# Altium schematic sheet regulators.SchDoc
size B
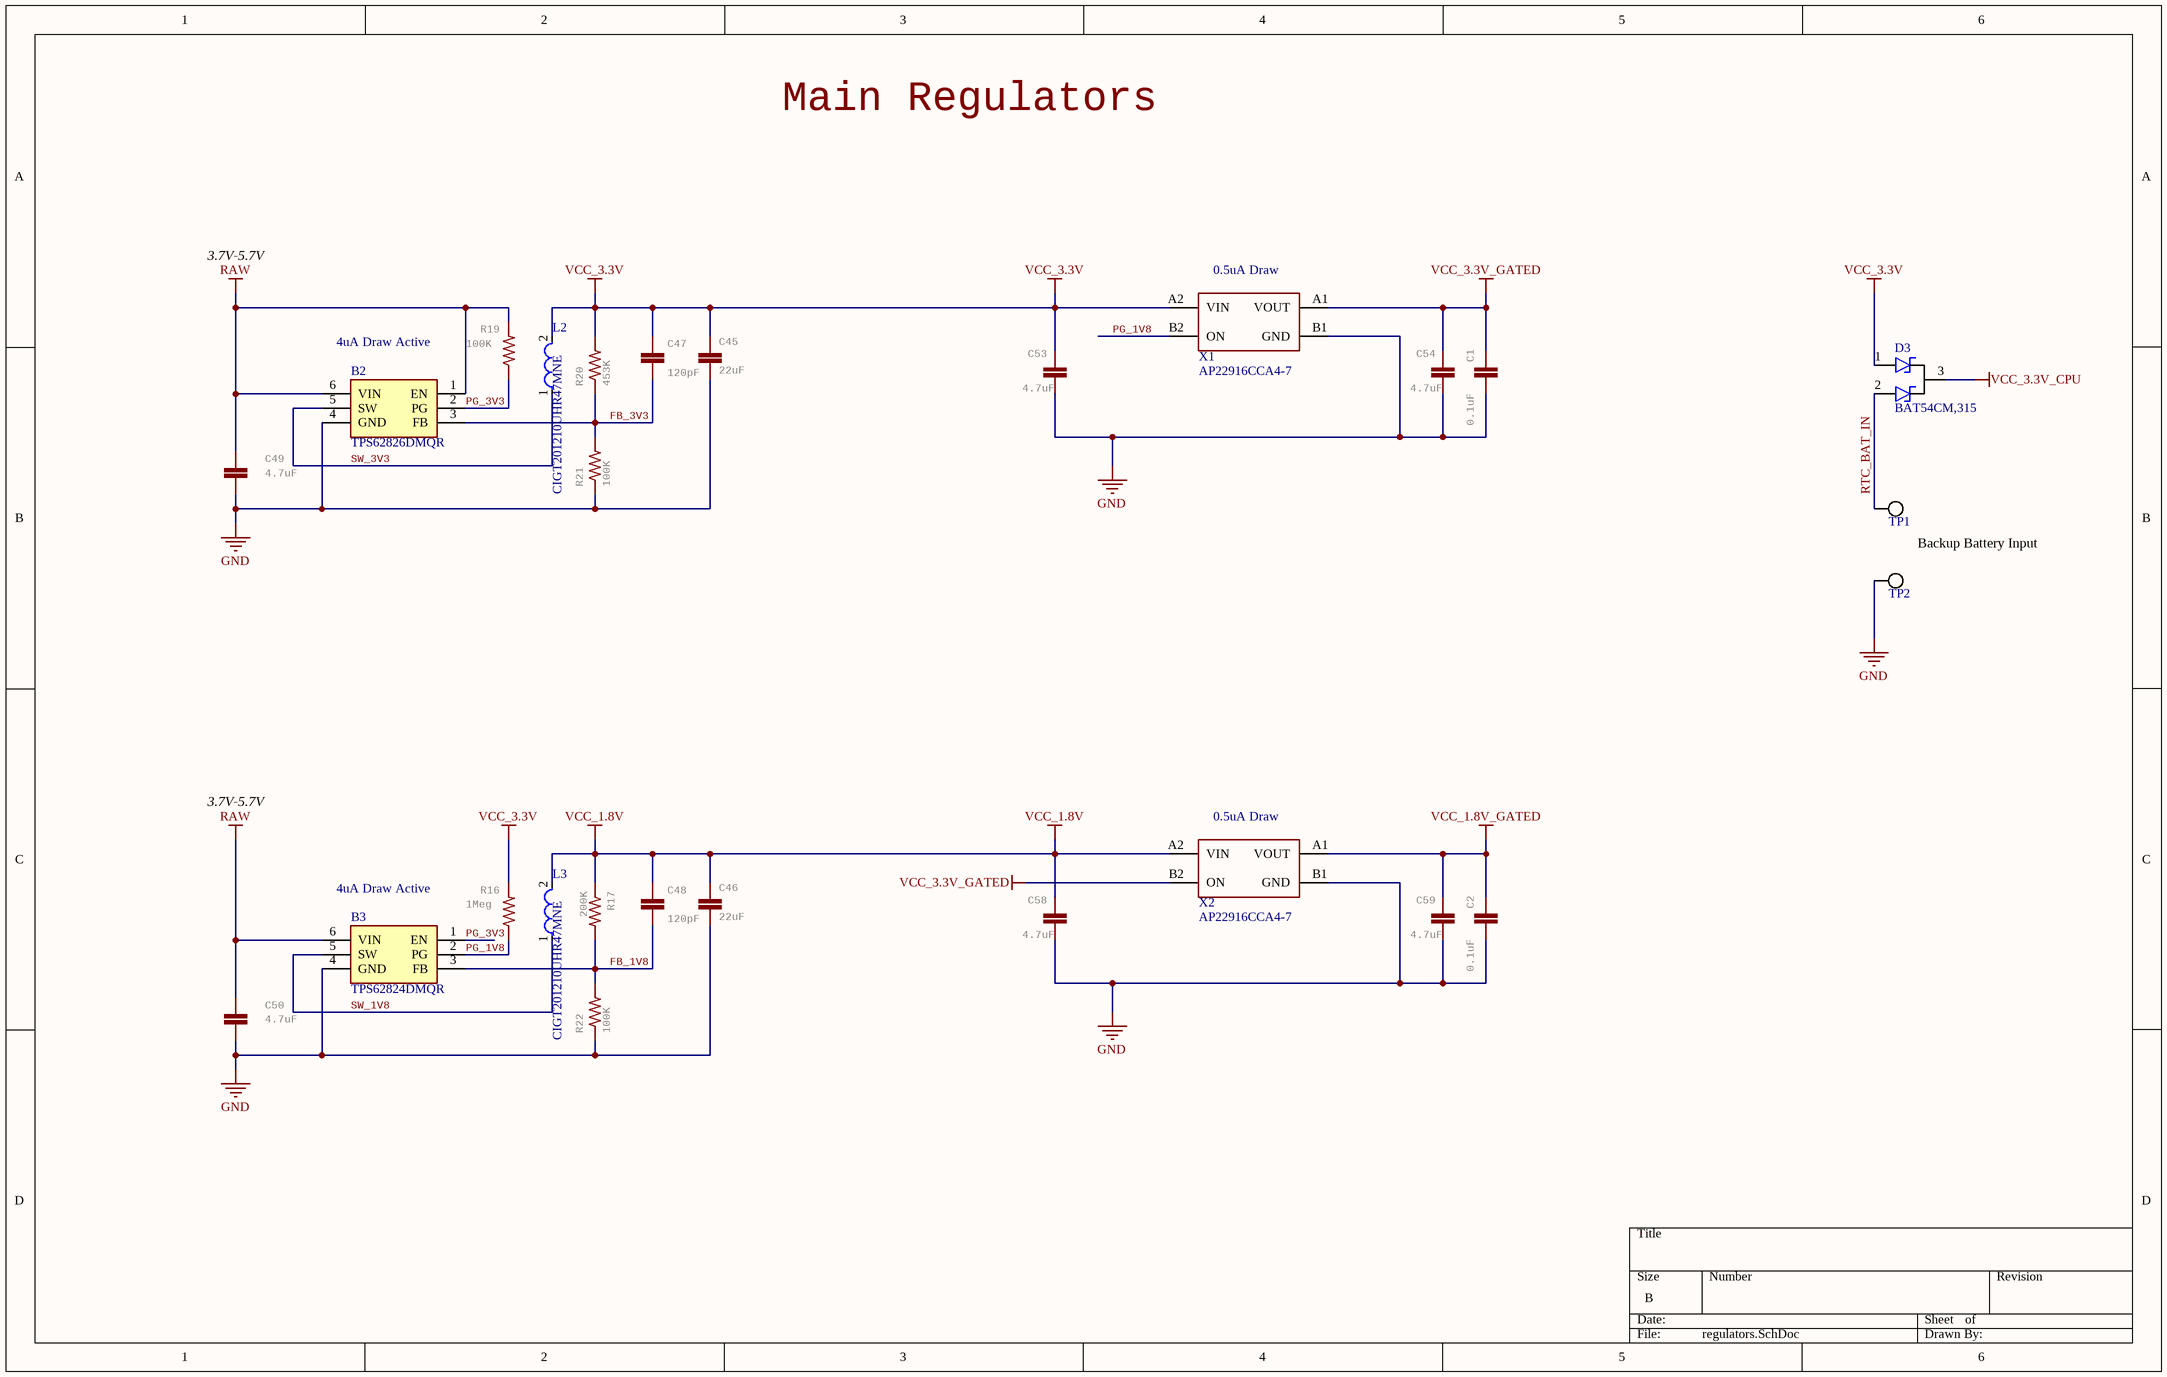
[diagram p0: regulators.SchDoc]

## Parts
B2  TPS62826DMQR  [TPS62826ADMQR]
B3  TPS62824DMQR  [TPS62826ADMQR]
C1  0.1uF  [0402-CAP]
C2  0.1uF  [0402-CAP]
C45  22uF  [0805]
C46  22uF  [0805]
C47  120pF  [C0201]
C48  120pF  [C0201]
C49  4.7uF  [0402-CAP]
C50  4.7uF  [0402-CAP]
C53  4.7uF  [0402-CAP]
C54  4.7uF  [0402-CAP]
C58  4.7uF  [0402-CAP]
C59  4.7uF  [0402-CAP]
D3  MPN: BAT54CM,315  [DFN1006]  (hidden comment: Dual Schottky)
L2  CIGT201210UHR47MNE  [0805]
L3  CIGT201210UHR47MNE  [0805]
R16  1Meg  [R0201]
R17  200K  [R0201]
R19  100K  [R0201]
R20  453K  [R0201]
R21  100K  [R0201]
R22  100K  [R0201]
TP1  TP  [TP_1p8]  (value not drawn)  (no BOM)
TP2  TP  [TP_1p8]  (value not drawn)  (no BOM)
X1  PMOS Load Switch  [AP22916CCA4-7]  (value not drawn)
X2  PMOS Load Switch  [AP22916CCA4-7]  (value not drawn)

## Nets
GND: B2.4(GND) B3.4(GND) C1.2 C2.2 C45.2 C46.2 C49.1 C50.1 C53.2 C54.2 C58.2 C59.2 R21.1 R22.1 TP2.1 X1.B1(GND) X2.B1(GND)
RAW: B2.1(EN) B2.6(VIN) B3.6(VIN) C49.2 C50.2 R19.2
VCC_1.8V: C46.1 C48.2 C58.1 L3.2 R17.1 X2.A2(VIN)
VCC_1.8V_GATED: C2.1 C59.1 X2.A1(VOUT)
VCC_3.3V: C45.1 C47.2 C53.1 D3.1 L2.2 R16.2 R20.2 X1.A2(VIN)
VCC_3.3V_CPU: D3.3
VCC_3.3V_GATED: C1.1 C54.1 X1.A1(VOUT) X2.B2(ON)
FB_1V8: B3.3(FB) C48.1 R17.2 R22.2
FB_3V3: B2.3(FB) C47.1 R20.1 R21.2
PG_1V8: B3.2(PG) R16.1 X1.B2(ON)
PG_3V3: B2.2(PG) B3.1(EN) R19.1
RTC_BAT_IN: D3.2 TP1.1
SW_1V8: B3.5(SW) L3.1
SW_3V3: B2.5(SW) L2.1

## Notes on the sheet
- Main Regulators
- 3.7V-5.7V
- (near X1) 0.5uA Draw
- (near B2) 4uA Draw Active
- Backup Battery Input
- (near X2) 0.5uA Draw
- (near B3) 4uA Draw Active

## Library data of the parts
B2 = TPS62826ADMQR: Switching Voltage Regulators 2.4-V to 5.5-V input, 3-A step-down converter with in 1.5-mm 1.5-mm QFN package; Manufacturer_Name: Texas Instruments; Geometry.Height: 1mm; Mouser Part Number: 595-TPS62826DMQR; Mouser Price/Stock: https://www.mouser.co.uk/ProductDetail/Texas-Instruments/TPS62826ADMQR?qs=KUoIvG%2F9Ila3pPUbedlDEw%3D%3D; Manufacturer_Part_Number: TPS62826DMQR; Datasheet Link: https://www.ti.com/lit/ds/symlink/tps62825a.pdf?ts=1608196934558&ref_url=https%253A%252F%252Fwww.ti.com%252Fstore%252Fti%252Fen%252Fp%252Fproduct%252F%253Fp%253DTPS62825ADMQR%2526keyMatch%253DTPS62825ADMQR%2526tisearch%253DSearch-EN-everything%2526usecase; MPN: TPS62826DMQR; Part Number: TPS62826DMQR
B3 = TPS62826ADMQR: Switching Voltage Regulators 2.4-V to 5.5-V input, 1-A step-down converter in 1.5-mm 1.5-mm QFN package; Manufacturer_Name: Texas Instruments; Geometry.Height: 1mm; Mouser Part Number: 595-TPS62824DMQR; Mouser Price/Stock: https://www.mouser.co.uk/ProductDetail/Texas-Instruments/TPS62826ADMQR?qs=KUoIvG%2F9Ila3pPUbedlDEw%3D%3D; Manufacturer_Part_Number: TPS62824DMQR; Datasheet Link: https://www.ti.com/lit/ds/symlink/tps62825a.pdf?ts=1608196934558&ref_url=https%253A%252F%252Fwww.ti.com%252Fstore%252Fti%252Fen%252Fp%252Fproduct%252F%253Fp%253DTPS62825ADMQR%2526keyMatch%253DTPS62825ADMQR%2526tisearch%253DSearch-EN-everything%2526usecase; MPN: TPS62824DMQR; Part Number: TPS62824DMQR
C1 C2 = C-EUC0201: CAPACITOR, European symbol; MPN: C0402C104Z4VAC; GateName_1: G$1; SymbolName_1: C-EU; POPULARITY: 0; LibraryName: rcl; DeviceSetName: C-EU; SPICEPREFIX: C; Part Number: C0402C104Z4VAC
C45 C46 = 22UF-0805-6.3V-20%: 22ÂµF ceramic capacitors    A capacitor is a passive two-terminal electrical component used to store electrical energy temporarily in an electric field.; MPN: CL21A226MQQNNNE; GateName_1: G$1; SymbolName_1: CAP; PROD_ID: CAP-08402; DeviceName: -0805-6.3V-20%; LibraryName: SparkFun-Capacitors; DeviceSetName: 22UF; Part Number: CL21A226MQQNNNE
C47 C48 = CAP0402-CAP: GateName_1: G$1; SymbolName_1: CAP; LibraryName: sfe; DeviceSetName: CAP
C49 C50 C53 C54 C58 C59 = CAP0402-CAP: CapacitorStandard 0603 ceramic capacitor, and 0.1" leaded capacitor.; MPN: JMK105BBJ475MV-F; GateName_1: G$1; SymbolName_1: CAP; DeviceName: 0402-CAP; LibraryName: sfe; DeviceSetName: CAP; Part Number: JMK105BBJ475MV-F
D3 = Dual Schottky: Part Number: BAT54CLT3G; Value: ?V
L2 L3 = CMP-00002-1: Power Inductor : LxW size(mm) 2012 Thickness1 Inductance (uH) 20%: 0.47; Current Rating: 3.6A; Shielding: Unshielded; Test Frequency: 1MHz; DC Resistance (DCR): 31mR; Saturation Current: 5.4A; Core Material: Metal,Composite; Value: 470nH; Tolerance: 20%; Packaging: Cut Tape; Case Code (Imperial): 0805; Case/Package: 0805; RoHS Compliant: Yes; Max Operating Temperature: 125°C; Series: CIGT; Min Operating Temperature: -40°C; Mounting Technology: Surface Mount; Case Code (Metric): 2012; MPN: CIGT201210UHR47MNE; Part Number: CIGT201210UHR47MNE
R16 R17 R19-R22 = RESISTOR0402-RES: GateName_1: G$1; SymbolName_1: RESISTOR; LibraryName: sfe; DeviceSetName: RESISTOR
X1 X2 = AP22916CCA4-7: MF: Diodes Inc; MPN: AP22916CCA4-7